# Altium schematic sheet design_6.SchDoc: design
size 414 x 279 mm; Date: 1/25/2021 11:39:22 PM; SheetNumber: 7; Origin: Eagle; GateName_1: G$1; SymbolName_1: A3-L-GUMSTIX; LibraryName: qualified_1; DeviceSetName: A3-L-GUMSTIX; A: A; B: B; C: C; D: D; E: E; F: F; G: G; H: H; 1: 1; 2: 2; 3: 3; 4: 4; 5: 5; Sheet: Sheet:; C:/Gumstix/gumstix-logo-16.bmp: C:/Gumstix/gumstix-logo-16.bmp; Board: Board:
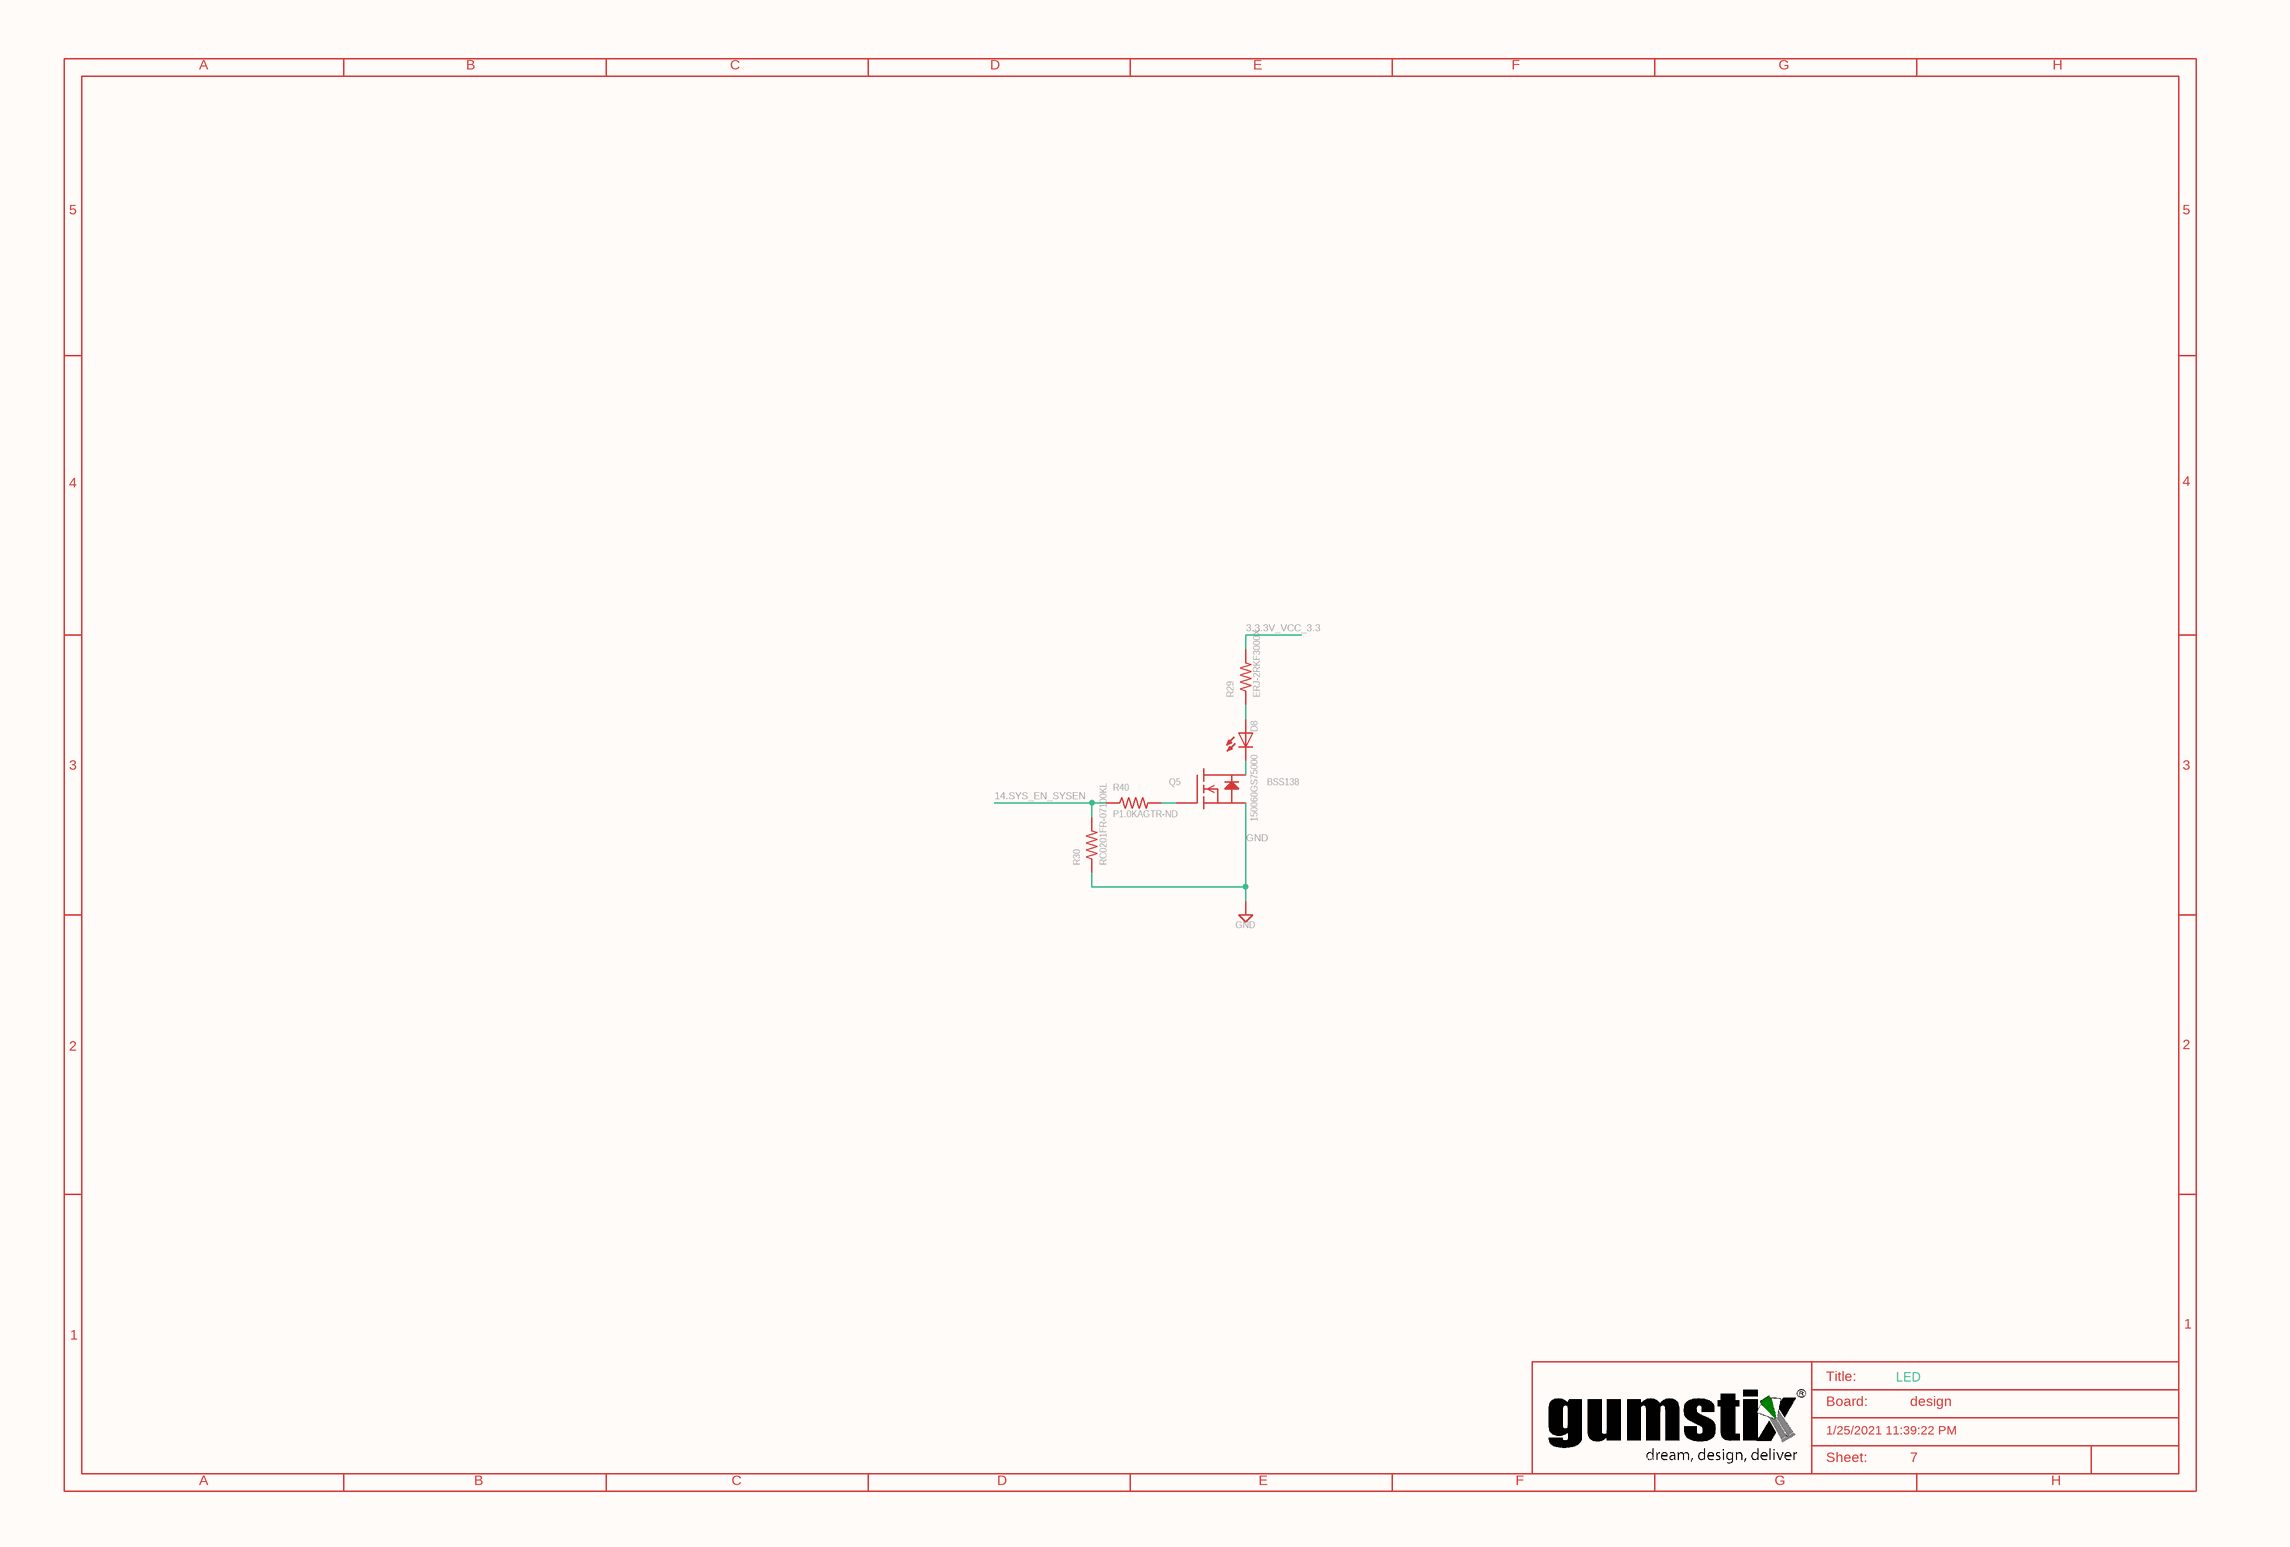
[diagram p0: design_6.SchDoc]

## Parts
D8  150060GS75000  [D0603]
Q5  BSS138  [SOT23]
R29  ERJ-2RKF3000X  [0402]
R30  RC0201FR-07100KL  [0201]
R40  P1.0KAGTR-ND  [0201]
SUPPLY96  GND

## Nets
3.3.3V_VCC_3.3: R29.2
14.SYS_EN_SYSEN: R30.2 R40.1
GND: Q5.2(S) R30.1 SUPPLY96.?1(GND)
NetD8_A: D8.A R29.1
NetD8_C: D8.C Q5.3(D)
NetQ5_1: Q5.1(G) R40.2

## Notes on the sheet
- A
- B
- C
- D
- E
- F
- G
- H
- 5
- 4
- 3
- 2
- 1
- Title:
- Board:
- LED
- design
- C:/Gumstix/gumstix-logo-16.bmp
- 1/25/2021 11:39:22 PM
- Sheet:
- 7

## Library data of the parts
D8 = 150060GS75000: GateName_1: G$1; SymbolName_1: LED; LibraryName: qualified_1; DeviceSetName: 150060GS75000; HEIGHT: 0.5
Q5 = BSS138: N-Channel Enhancement MOSFET; GateName_1: G$1; SymbolName_1: IGFET-EN-GDS; LibraryName: qualified_1; DeviceSetName: BSS138; HEIGHT: 1.12
R29 = ERJ-2RKF3000X: GateName_1: G$1; SymbolName_1: R-US; LibraryName: qualified_1; DeviceSetName: ERJ-2RKF3000X; HEIGHT: 0.35
R30 = RC0201FR-07100KL: GateName_1: G$1; SymbolName_1: R-US; LibraryName: qualified_1; DeviceSetName: RC0201FR-07100KL; HEIGHT: 0.25
R40 = P1.0KAGTR-ND: GateName_1: G$1; SymbolName_1: R-US; LibraryName: qualified_1; DeviceSetName: P1.0KAGTR-ND; HEIGHT: 0.25
SUPPLY96 = GND: SUPPLY SYMBOL; SymbolName_1: GND-2; GateName_1: GND; LibraryName: qualified_1; DeviceSetName: GND